# EAGLE design LB_BIT_w11_wirelessReceiver_v03(3_3)OHW (EAGLE 6.6.0)

## Sheet 1 of 2
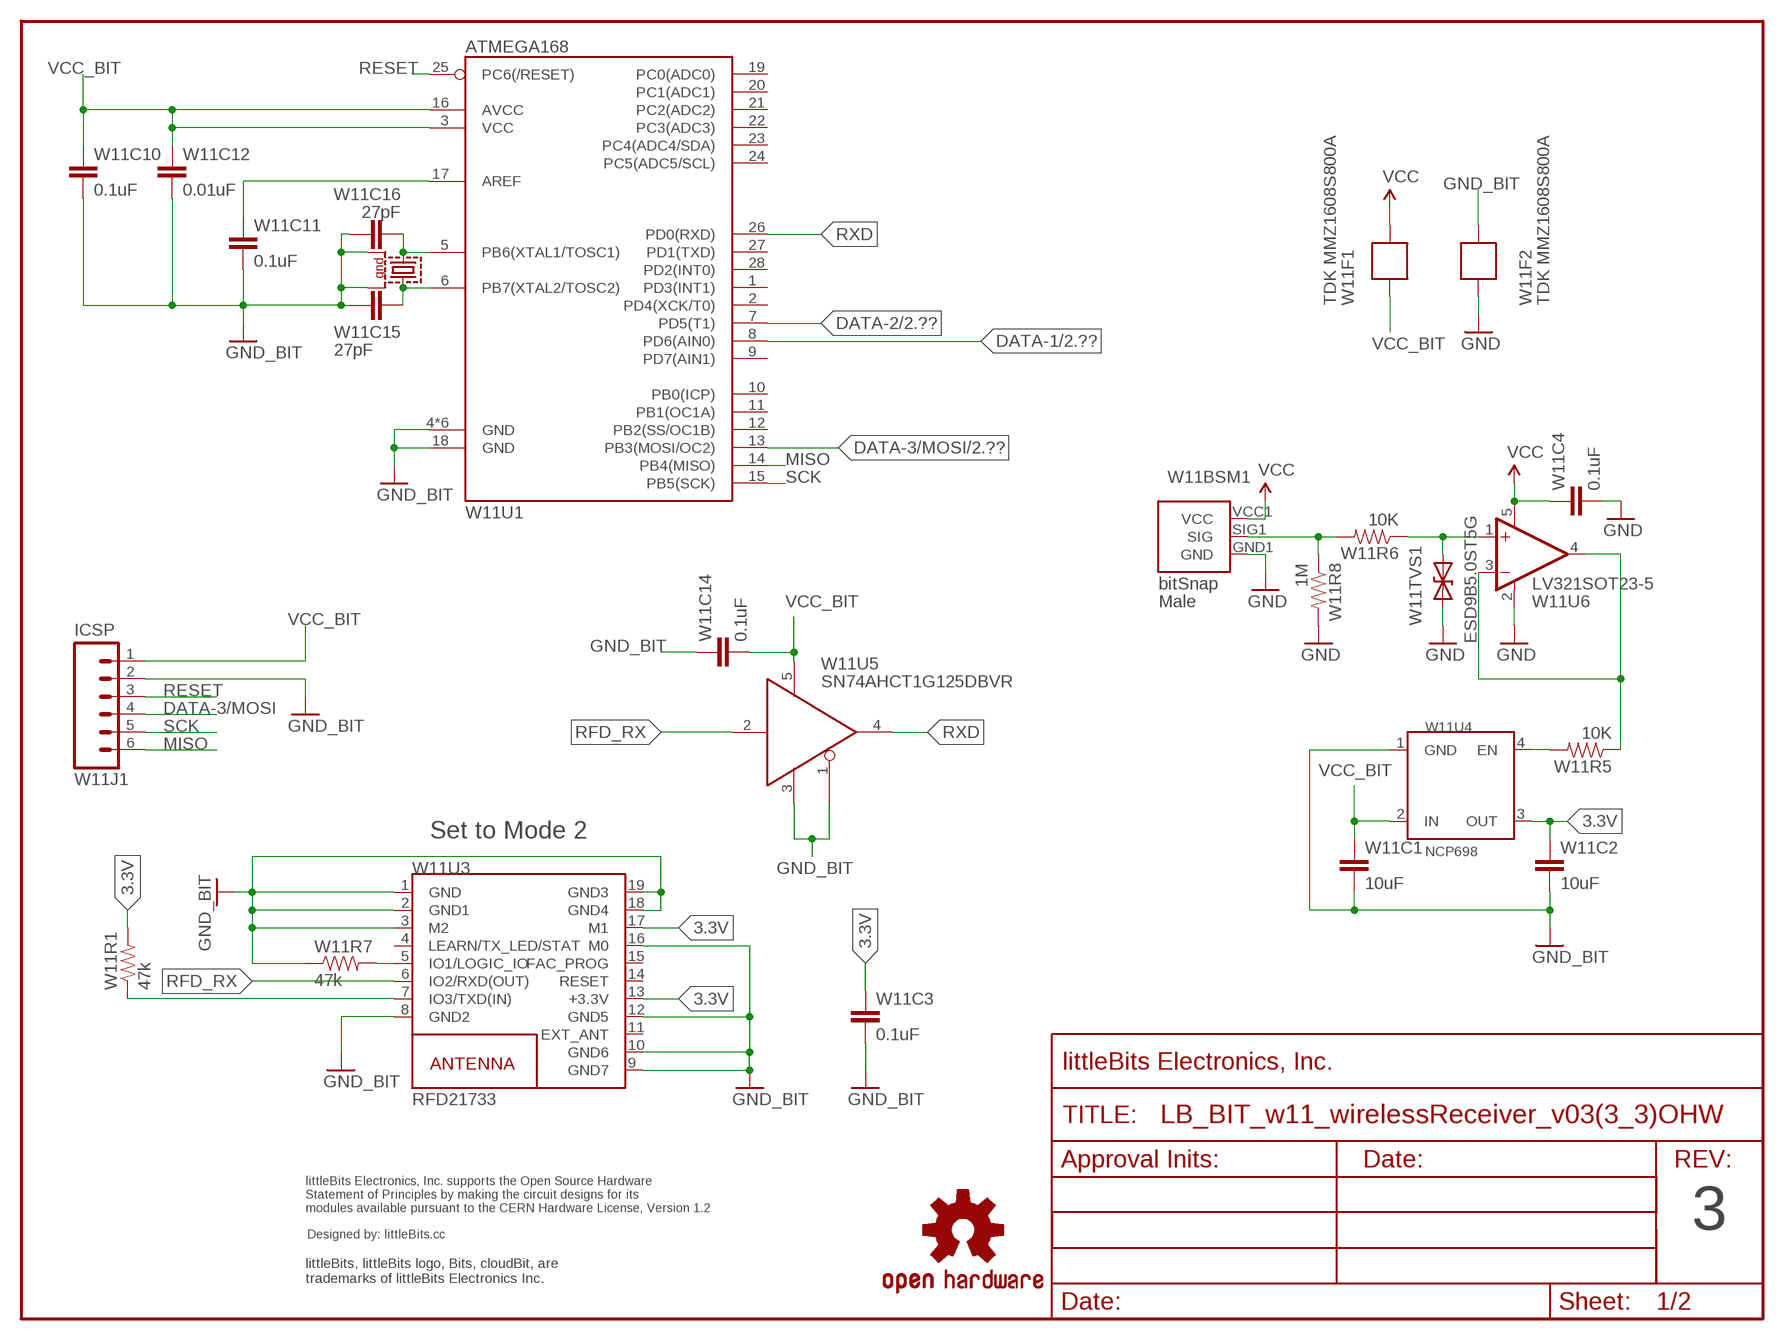
[diagram p0: schematic, sheet 1]

### Parts
FRAME1  FRAME-LETTER-OHWOHW  [FABDWG01-OHW]
U$3  OSHW-LOGOL  [OSHW-LOGO-L]
U$7  OSHWCREDIT  [OSHWCREDIT]
W11BSM1  BITSNAP_V03_MALE  [BITSNAP_V03_MALE]
W11C1  10uF  CAPCAP-0603  [CAP-0603]
W11C2  10uF  CAPCAP-0603  [CAP-0603]
W11C3  0.1uF  CAPCAP-0603  [CAP-0603]
W11C4  0.1uF  CAPCAP-0603  [CAP-0603]
W11C10  0.1uF  CAPCAP-0603  [CAP-0603]
W11C11  0.1uF  CAPCAP-0603  [CAP-0603]
W11C12  0.01uF  CAPCAP-0603  [CAP-0603]
W11C14  0.1uF  CAPCAP-0603  [CAP-0603]
W11C15  27pF  CAPCAP-0603  [CAP-0603]
W11C16  27pF  CAPCAP-0603  [CAP-0603]
W11F1  TDK MMZ1608S800A  FERRITE-BEAD  [R0603]
W11F2  TDK MMZ1608S800A  FERRITE-BEAD  [R0603]
W11J1  ICSP  HRD-60.1INCH_NO_SILKSCREEN  [SIP6-SM-0.1IN-NOS.S.]
W11R1  47k  RESISTOR0603  [RES-0603]
W11R5  10K  RESISTOR0603  [RES-0603]
W11R6  10K  RESISTOR0603  [RES-0603]
W11R7  47k  RESISTOR0603  [RES-0603]
W11R8  1M  RESISTOR0603  [RES-0603]
W11TVS1  ESD9B5.0ST5G  DIODE-TVSSOD-923  [SOD-923]
W11U1  ATMEGA168  ATMEGA168-28PINVFQFN-28  [VQFN28]
W11U3  RFD21733  RFD_CHIP  [RFD21733]
W11U4  NCP698  [NCP698_SC82-AB]
W11U5  SN74AHCT1G125DBVR  5V_TO_3.3V_LEVEL-SHIFTERSOT23-5  [SOT23-5]
W11U6  LV321SOT23-5  [SOT23-5]
W11X1  7B-8.000MAAJ-T  CRYSTAL-SMD-7B-SERIES-TXC  [CRYSTAL-SMD-7B-SERIES-5X3.2MM]

### Nets
3.3V: W11C2.1 W11C3.1 W11R1.2 W11U3.13(+3.3V) W11U3.17(M1) W11U4.3(OUT)
DATA-1: W11U1.8(PD6(AIN0)) ; also sheet 2
DATA-2: W11U1.7(PD5(T1)) ; also sheet 2
DATA-3/MOSI: W11J1.4 W11U1.13(PB3(MOSI/OC2)) ; also sheet 2
ENABLE: W11R5.2 W11U4.4(EN)
GND: W11BSM1.GND1(GND) W11C4.2 W11F2.2 W11R8.2 W11TVS1.1(A) W11U6.2(V-) ; also sheet 2
GND_BIT: W11C1.2 W11C2.2 W11C3.2 W11C10.2 W11C11.2 W11C12.2 W11C14.1 W11C15.2 W11C16.1 W11F2.1 W11J1.2 W11R7.1 W11U1.4(GND) W11U1.18(GND) W11U1.TH(GND) W11U1.TH@1(GND) W11U1.TH@2(GND) W11U1.TH@3(GND) W11U1.TH@4(GND) W11U3.1(GND) W11U3.2(GND1) W11U3.3(M2) W11U3.8(GND2) W11U3.9(GND7) W11U3.10(GND6) W11U3.12(GND5) W11U3.16(M0) W11U3.18(GND4) W11U3.19(GND3) W11U4.1(GND) W11U5.1 W11U5.3 W11X1.P$2 W11X1.P$4
MISO: W11J1.6 W11U1.14(PB4(MISO))
N$1: W11R6.1 W11TVS1.2(C) W11U6.1(+IN)
N$4: W11C11.1 W11U1.17(AREF)
N$6: W11R7.2 W11U3.5(IO1/LOGIC_IO)
N$7: W11BSM1.SIG1(SIG) W11R6.2 W11R8.1
N$8: W11C16.2 W11U1.5(PB6(XTAL1/TOSC1)) W11X1.P$1
N$9: W11C15.1 W11U1.6(PB7(XTAL2/TOSC2)) W11X1.P$3
N$10: W11R5.1 W11U6.3(-IN) W11U6.4(OUT)
RESET: W11J1.3 W11U1.25(PC6(/RESET))
RFD_RX: W11U3.6(IO2/RXD(OUT)) W11U5.2
RFD_TX: W11R1.1 W11U3.7(IO3/TXD(IN))
RXD: W11U1.26(PD0(RXD)) W11U5.4
SCK: W11J1.5 W11U1.15(PB5(SCK))
VCC: W11BSM1.VCC1(VCC) W11C4.1 W11F1.1 W11U6.5(V+) ; also sheet 2
VCC_BIT: W11C1.1 W11C10.1 W11C12.1 W11C14.2 W11F1.2 W11J1.1 W11U1.3(VCC) W11U1.16(AVCC) W11U4.2(IN) W11U5.5
Unconnected: W11U1.1(PD3(INT1)) W11U1.2(PD4(XCK/T0)) W11U1.9(PD7(AIN1)) W11U1.10(PB0(ICP)) W11U1.11(PB1(OC1A)) W11U1.12(PB2(SS/OC1B)) W11U1.19(PC0(ADC0)) W11U1.20(PC1(ADC1)) W11U1.21(PC2(ADC2)) W11U1.22(PC3(ADC3)) W11U1.23(PC4(ADC4/SDA)) W11U1.24(PC5(ADC5/SCL)) W11U1.27(PD1(TXD)) W11U1.28(PD2(INT0)) W11U3.4(LEARN/TX_LED/STAT) W11U3.11(EXT_ANT) W11U3.14(RESET) W11U3.15(FAC_PROG)

### Notes on the sheet
- Set to Mode 2
- 3

## Sheet 2 of 2
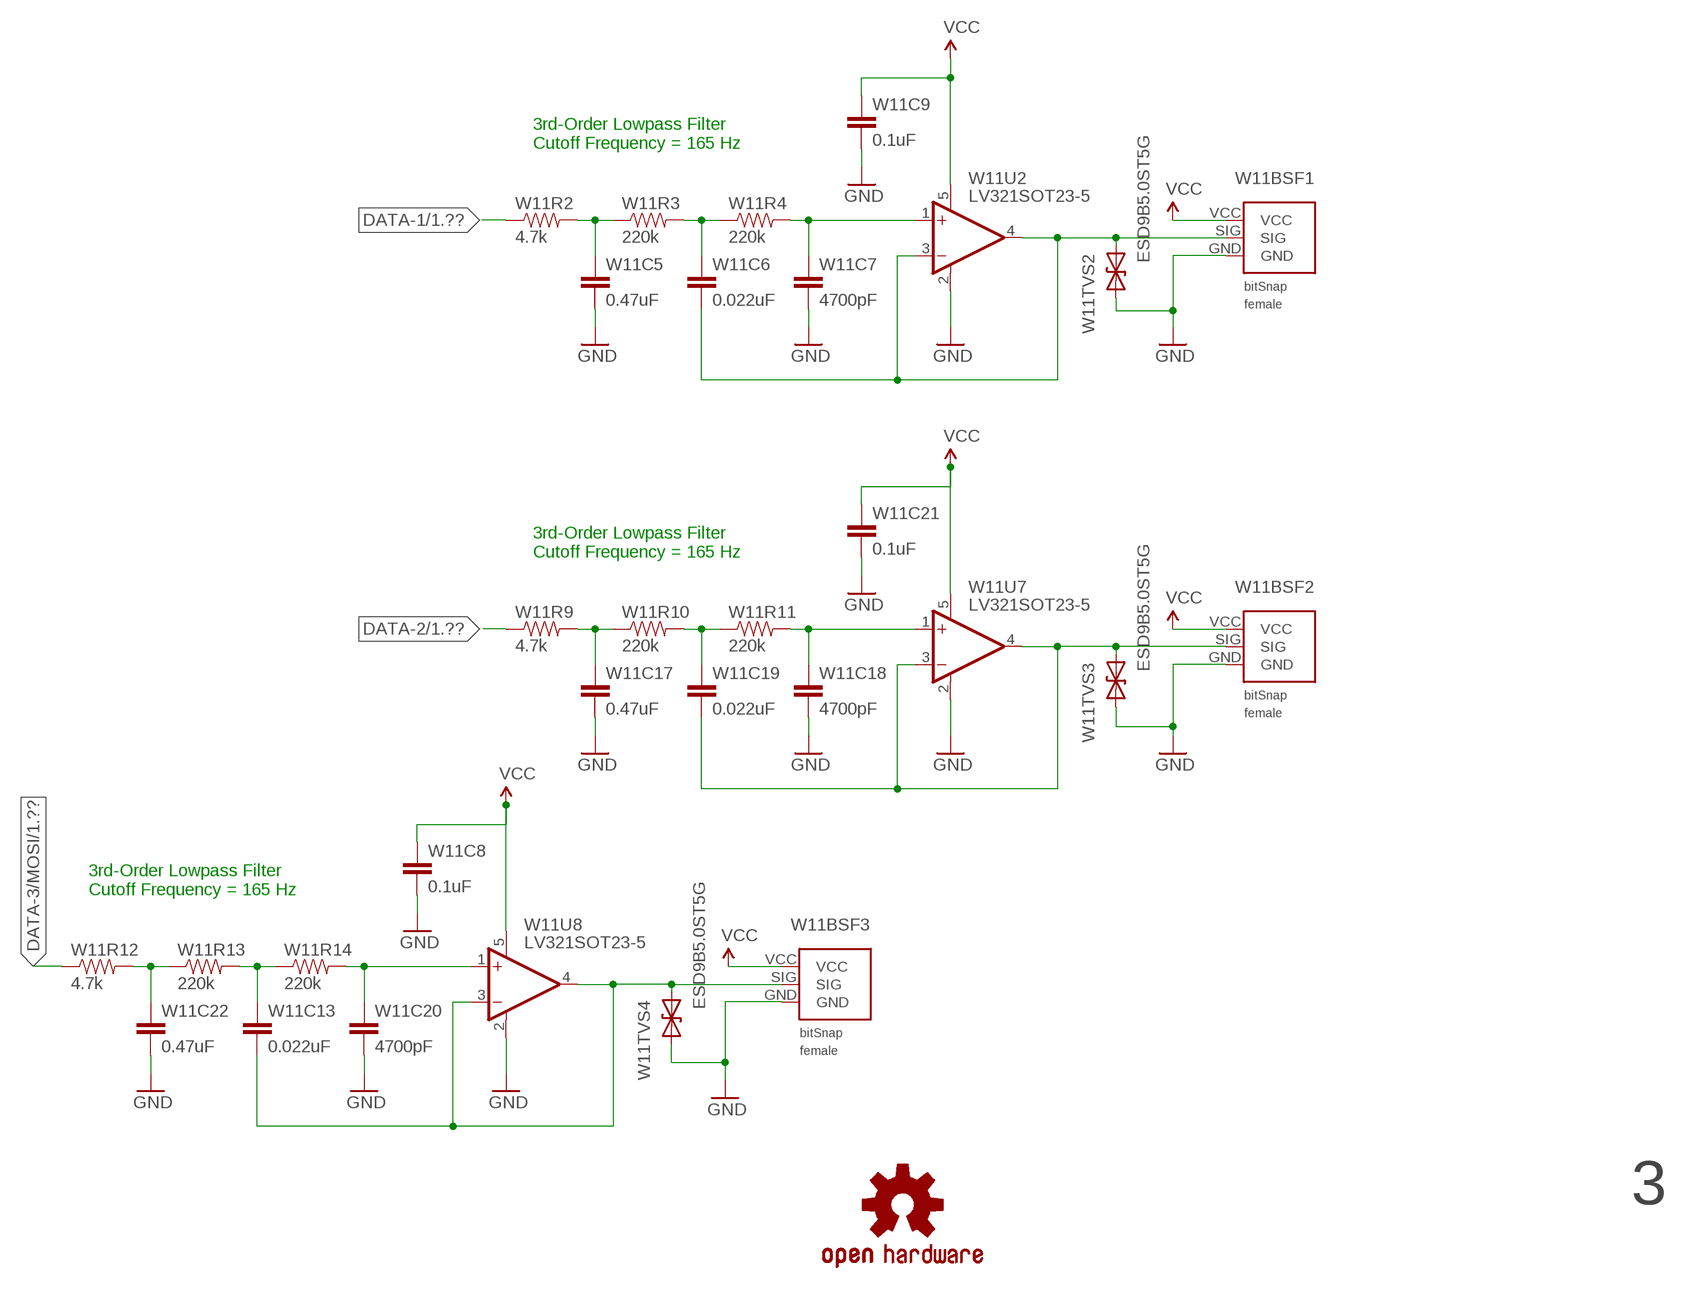
[diagram p1: schematic, sheet 2]

### Parts
U$9  OSHW-LOGOL  [OSHW-LOGO-L]
W11BSF1  BITSNAP_V03_FEMALE  [BITSNAP_V03_FEMALE]
W11BSF2  BITSNAP_V03_FEMALE  [BITSNAP_V03_FEMALE]
W11BSF3  BITSNAP_V03_FEMALE  [BITSNAP_V03_FEMALE]
W11C5  0.47uF  CAPCAP-0603  [CAP-0603]
W11C6  0.022uF  CAPCAP-0603  [CAP-0603]
W11C7  4700pF  CAPCAP-0603  [CAP-0603]
W11C8  0.1uF  CAPCAP-0603  [CAP-0603]
W11C9  0.1uF  CAPCAP-0603  [CAP-0603]
W11C13  0.022uF  CAPCAP-0603  [CAP-0603]
W11C17  0.47uF  CAPCAP-0603  [CAP-0603]
W11C18  4700pF  CAPCAP-0603  [CAP-0603]
W11C19  0.022uF  CAPCAP-0603  [CAP-0603]
W11C20  4700pF  CAPCAP-0603  [CAP-0603]
W11C21  0.1uF  CAPCAP-0603  [CAP-0603]
W11C22  0.47uF  CAPCAP-0603  [CAP-0603]
W11R2  4.7k  RESISTOR0603  [RES-0603]
W11R3  220k  RESISTOR0603  [RES-0603]
W11R4  220k  RESISTOR0603  [RES-0603]
W11R9  4.7k  RESISTOR0603  [RES-0603]
W11R10  220k  RESISTOR0603  [RES-0603]
W11R11  220k  RESISTOR0603  [RES-0603]
W11R12  4.7k  RESISTOR0603  [RES-0603]
W11R13  220k  RESISTOR0603  [RES-0603]
W11R14  220k  RESISTOR0603  [RES-0603]
W11TVS2  ESD9B5.0ST5G  DIODE-TVSSOD-923  [SOD-923]
W11TVS3  ESD9B5.0ST5G  DIODE-TVSSOD-923  [SOD-923]
W11TVS4  ESD9B5.0ST5G  DIODE-TVSSOD-923  [SOD-923]
W11U2  LV321SOT23-5  [SOT23-5]
W11U7  LV321SOT23-5  [SOT23-5]
W11U8  LV321SOT23-5  [SOT23-5]

### Nets
DATA-1: W11R2.1 ; also sheet 1
DATA-2: W11R9.1 ; also sheet 1
DATA-3/MOSI: W11R12.1 ; also sheet 1
GND: W11BSF1.GND W11BSF2.GND W11BSF3.GND W11C5.2 W11C7.2 W11C8.2 W11C9.2 W11C17.2 W11C18.2 W11C20.2 W11C21.2 W11C22.2 W11TVS2.1(A) W11TVS3.1(A) W11TVS4.1(A) W11U2.2(V-) W11U7.2(V-) W11U8.2(V-) ; also sheet 1
N$2: W11C6.1 W11R3.2 W11R4.1
N$3: W11C5.1 W11R2.2 W11R3.1
N$5: W11C7.1 W11R4.2 W11U2.1(+IN)
N$11: W11C17.1 W11R9.2 W11R10.1
N$12: W11C18.1 W11R11.2 W11U7.1(+IN)
N$14: W11C19.1 W11R10.2 W11R11.1
N$16: W11C22.1 W11R12.2 W11R13.1
N$17: W11C20.1 W11R14.2 W11U8.1(+IN)
N$19: W11C13.1 W11R13.2 W11R14.1
OUT-1: W11BSF1.SIG W11C6.2 W11TVS2.2(C) W11U2.3(-IN) W11U2.4(OUT)
OUT-2: W11BSF2.SIG W11C19.2 W11TVS3.2(C) W11U7.3(-IN) W11U7.4(OUT)
OUT-3: W11BSF3.SIG W11C13.2 W11TVS4.2(C) W11U8.3(-IN) W11U8.4(OUT)
VCC: W11BSF1.VCC W11BSF2.VCC W11BSF3.VCC W11C8.1 W11C9.1 W11C21.1 W11U2.5(V+) W11U7.5(V+) W11U8.5(V+) ; also sheet 1

### Notes on the sheet
- 3rd-Order Lowpass Filter
  Cutoff Frequency = 165 Hz
- 3rd-Order Lowpass Filter
  Cutoff Frequency = 165 Hz
- 3rd-Order Lowpass Filter
  Cutoff Frequency = 165 Hz
- 3

## Library data of the parts
FRAME1 = LITTLEBITS:FRAME-LETTER-OHW
U$3 U$9 = LITTLEBITS:OSHW-LOGO: Open Source Hardware Logo This logo indicates the piece of hardware it is found on incorporates a OSHW license and/or adheres to the definition of open source hardware found here: http://freedomdefined.org/OSHW
U$7 = LITTLEBITS:OSHWCREDIT
W11BSF1-W11BSF3 = bitSnap:BITSNAP_V03_FEMALE
W11BSM1 = bitSnap:BITSNAP_V03_MALE
W11C1-W11C22 = LITTLEBITS:CAP
W11F1 W11F2 = LITTLEBITS:FERRITE-BEAD
W11J1 = LITTLEBITS:HRD-6
W11R1-W11R14 = LITTLEBITS:RESISTOR
W11TVS1-W11TVS4 = LITTLEBITS:DIODE-TVS: Bidirectional Transient Voltage Suppression Diode: Device conducts in avalanche mode after reaching a part dependent voltage threshold. Used for limiting voltage spikes on ESD sensitive inputs and outputs.; IEC_ESD_PROT0: +/-18kV; LB_PN: ?; MPN: ESD9B5.0ST5G; V_CLAMP: ?; V_OPERATION: 5V
W11U1 = LITTLEBITS:ATMEGA168-28PIN
W11U2 W11U6-W11U8 = LITTLEBITS:LV321
W11U3 = LITTLEBITS:RFD_CHIP
W11U4 = LITTLEBITS:NCP698
W11U5 = LITTLEBITS:5V_TO_3.3V_LEVEL-SHIFTER: SN74LVC1G125
W11X1 = LITTLEBITS:CRYSTAL-SMD-7B-SERIES-TXC; MFG: TXC; MPN: 7B SERIES

## Board
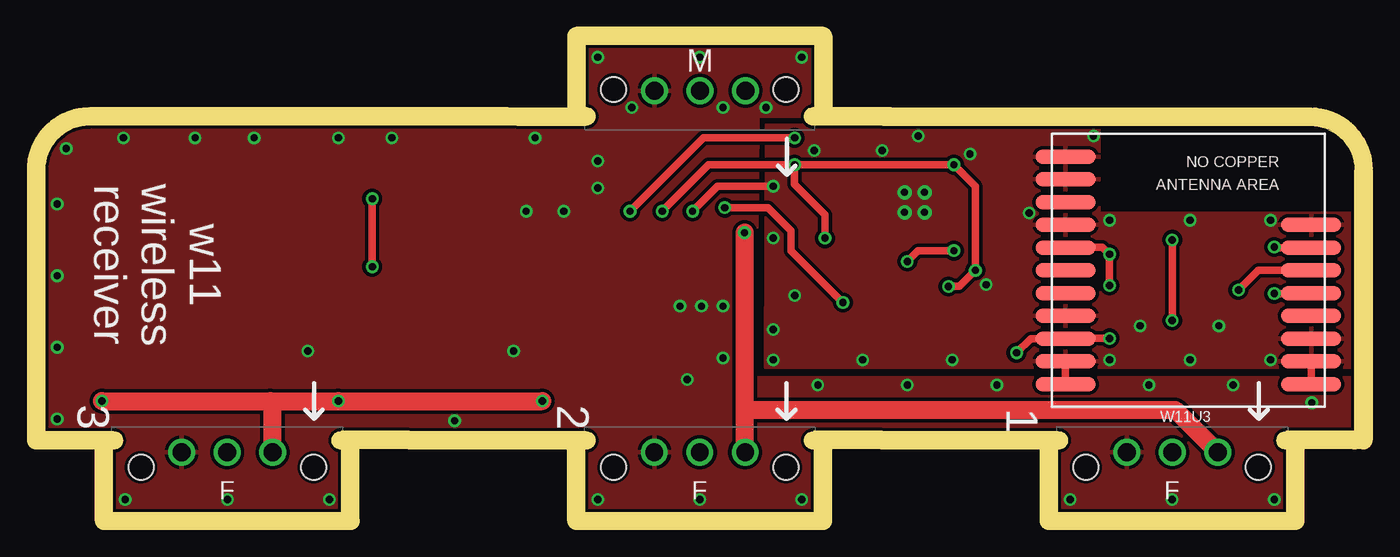
[diagram p2: board, top side]
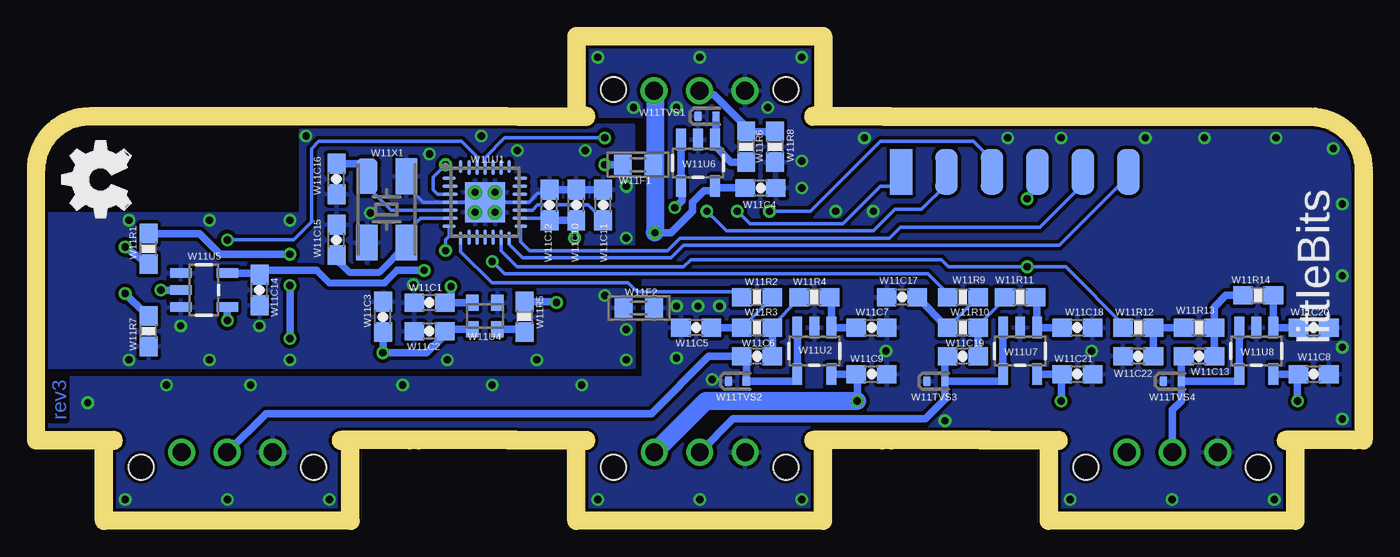
[diagram p3: board, bottom side, seen from below]

Size 73.2 x 26.1 mm. Coordinates in mm from the lower left corner, seen from the top.
Outline: 0,4.5 0,19.1 arc-90 2.5,21.6 26.4,21.6
Outline: 73.2,4.5 73.2,19.1 arc90 70.7,21.6 46.8,21.6
Outline: 20.4,4.5 30.17,4.5
Outline: 46.8,4.5 52.85,4.5
Copper layers (1*16): Top 0.035mm / dielectric 1.5mm / Bottom 0.035mm
Design rules "littleBitsDRC": minimum track width 0.2mm, minimum drill 0.4mm, track to track 0.2mm, track to pad 0.2mm, pad to pad 0.2mm, via to via 0.2mm, smd to smd 0mil, copper to edge 0.2mm, drill to drill 0.2mm, minimum pad ring 0.2mm, minimum via ring 0.15mm, stop-mask expansion 0.1mm, vias tented up to drill 0mil, thermal gap 0.2mm
tRestrict: area 59,16.8 to 73.2,21.6
bRestrict: area 59,16.8 to 73.2,21.6
Milling: 10 lines

### Footprints (pad centres in the part's own frame; a part is rotated, then mirrored left to right if it is on the bottom)
BITSNAP_V03_FEMALE = drill 1: GND 3.91,3.33; SIG 6.45,3.33; VCC 8.99,3.33 | hole 1.4: 1.63,2.5; 11.27,2.5
BITSNAP_V03_MALE = drill 1: GND1 8.98,2.56; SIG1 6.44,2.56; VCC1 3.9,2.56 | hole 1.4: 11.27,2.5; 1.63,2.5
CAP-0603 = smd 1.1 x 1: 1 -0.85,0; 2 0.85,0
R0603 = smd 1 x 1.1: 1 -0.85,0; 2 0.85,0
SIP6-SM-0.1IN-NOS.S. = smd 1.27 x 2.54: 1 -6.35,0; 2 -3.81,0; 3 -1.27,0; 4 1.27,0; 5 3.81,0; 6 6.35,0
RES-0603 = smd 1.1 x 1: 1 -0.85,0; 2 0.85,0
SOD-923 = smd 0.4 x 0.5: 1 -0.5,0; 2 0.5,0
VQFN28 = smd 0.75 x 0.2: 1 -2,1.35; 7 -2,-1.35; 15 2,-1.35; 21 2,1.35 | smd 0.85 x 0.2: 2 -1.95,0.9; 3 -1.95,0.455; 4 -1.95,0; 5 -1.95,-0.45; 6 -1.95,-0.9; 16 1.95,-0.9; 17 1.95,-0.45; 18 1.95,0; 19 1.95,0.45; 20 1.95,0.9 | smd 0.2 x 0.75: 8 -1.35,-2; 14 1.35,-2; 22 1.35,2; 28 -1.35,2 | smd 0.2 x 0.85: 9 -0.9,-1.95; 10 -0.45,-1.95; 11 0,-1.95; 12 0.45,-1.95; 13 0.9,-1.95; 23 0.9,1.95; 24 0.45,1.95; 25 0,1.95; 26 -0.45,1.95; 27 -0.9,1.95 | smd 2.25 x 2.25: TH 0,0 | drill 0.406 pad 0.406: TH@1 -0.559,0.559; TH@2 0.559,0.559; TH@3 -0.559,-0.559; TH@4 0.559,-0.559
SOT23-5 = smd 0.55 x 1.2: 1 -0.95,-1.3; 2 0,-1.3; 3 0.95,-1.3; 4 0.95,1.3; 5 -0.95,1.3
RFD21733 = smd 3.353 x 0.813: 1 -6.858,6.35; 2 -6.858,5.08; 3 -6.858,3.81; 4 -6.858,2.54; 5 -6.858,1.27; 6 -6.858,0; 7 -6.858,-1.27; 8 -6.858,-2.54; 9 6.858,-6.35; 10 6.858,-5.08; 11 6.858,-3.81; 12 6.858,-2.54; 13 6.858,-1.27; 14 6.858,0; 15 6.858,1.27; 16 6.858,2.54; 17 6.858,3.81; 18 6.858,5.08; 19 6.858,6.35
NCP698_SC82-AB = smd 0.7 x 0.9: 1 -0.7,-0.7; 2 0.7,-0.7; 3 0.7,0.8; 4 -0.7,0.8
CRYSTAL-SMD-7B-SERIES-5X3.2MM = smd 2 x 1.2: P$1 -1.85,-1.1; P$2 1.85,-1.1; P$3 1.85,1.1; P$4 -1.85,1.1

### Placement (x,y rotation side)
FRAME1  23,-12.9 0 top  (outside the outline)
U$3  -2.3,-83.3 0 top  (outside the outline)
U$7  -65.6,-78.5 0 top  (outside the outline)
U$9  -2.3,-83.3 0 top  (outside the outline)
U$21  [OSHW_FILLX150_NOTEXT]  68.4,15.62 0 top
W11BSF1  56.55,0 0 top
W11BSF2  30.15,0 0 top
W11BSF3  3.75,0 0 top
W11BSM1  43.05,26.1 180 top
W11C1  51.7,11.7 180 bottom
W11C2  51.7,10.1 180 bottom
W11C3  54.3,10.9 90 bottom
W11C4  33.2,18.1 0 bottom
W11C5  36.8,10.3 180 bottom
W11C6  33.4,8.7 180 bottom
W11C7  27,10.3 0 bottom
W11C8  2.3,7.7 0 bottom
W11C9  27,7.7 0 bottom
W11C10  43.5,17.15 90 bottom
W11C11  42,17.15 90 bottom
W11C12  45,17.15 90 bottom
W11C13  8.7,8.7 180 bottom
W11C14  61.2,12.4 90 bottom
W11C15  56.9,15.2 90 bottom
W11C16  56.9,18.6 90 bottom
W11C17  25.3,12 180 bottom
W11C18  15.5,10.3 0 bottom
W11C19  21.9,8.7 180 bottom
W11C20  2.3,10.3 0 bottom
W11C21  15.5,7.7 0 bottom
W11C22  12.1,8.7 180 bottom
W11F1  40.05,19.4 180 bottom
W11F2  40,11.4 0 bottom
W11J1  19,19 0 bottom
W11R1  67.4,14.7 90 bottom
W11R2  33.4,12 0 bottom
W11R3  33.4,10.3 0 bottom
W11R4  30.2,12 0 bottom
W11R5  46.4,10.9 270 bottom
W11R6  34,20.4 90 bottom
W11R7  67.4,10.1 90 bottom
W11R8  32.4,20.4 270 bottom
W11R9  21.9,12 0 bottom
W11R10  21.9,10.3 0 bottom
W11R11  18.7,12 0 bottom
W11R12  12.1,10.3 0 bottom
W11R13  8.7,10.3 0 bottom
W11R14  5.4,12.1 0 bottom
W11TVS1  36.2,22.1 0 bottom
W11TVS2  34.5,7.3 0 bottom
W11TVS3  23.4,7.3 0 bottom
W11TVS4  10.2,7.3 0 bottom
W11U1  48.6,17.3 0 bottom
W11U2  30.2,9 180 bottom
W11U3  63.9,13.5 180 top
W11U4  48.6,11 180 bottom
W11U5  64.3,12.4 270 bottom
W11U6  36.7,19.5 180 bottom
W11U7  18.7,9 180 bottom
W11U8  5.5,9 180 bottom
W11X1  54.1,16.9 270 bottom

### Tracks (layer width: path | path; a pad name or v marks a point on that pad's centre or on a via)
3.3V  (via drill 0.41)
  Top 0.203: 58.35,9.8 arc45 58.47,9.75 58.5,9.75
  Top 0.406: 58.35,9.75 57.1,9.75 W11U3.17 55.09,9.69 v54.3,8.9 | 58.35,9.75 58.1,9.65 58.15,9.7 v59.5,9.7 | 58.35,9.8 58.35,9.75 | W11U3.13 arc90 57.06,14.75 57.6,14.8 59.1,14.8 v59.5,14.4 v59.5,12.65
  Bottom 0.406: v59.5,9.7 v59.5,12.65 | W11U4.3 50.75,10.2 arc-90 W11C2.1 50.9,10.05 50.95,9.8 51.85,8.9 v54.3,8.9 W11C3.1 | W11R1.2 64.55,15.55 63.4,14.4 v59.5,14.4
DATA-1
  Bottom 0.2: 49.95,14.55 W11U1.8
  Bottom 0.203: 34.4,12.3 40.1,12.3 40.6,12.8 48.2,12.8 49.95,14.55
  Bottom 0.406: W11R2.1 34.25,11.85 34.4,12.3
DATA-2  (via drill 0.41)
  Top 0.406: v50.8,14.6 48.8,14.6 v48.2,14
  Bottom 0.2: W11U1.7 50.6,15.4 50.8,15.2 v50.8,14.6 | 47.5,13.3 23.85,13.3 22.55,12
  Bottom 0.203: v48.2,14 47.5,13.3
  Bottom 0.406: 22.55,12 W11R9.1 | 22.55,11.8 W11R9.1 | 22.6,11.85 W11R9.1
DATA-3/MOSI  (via drill 0.41)
  Top 0.406: v18.3,17.5 v18.3,13.7
  Bottom 0.2: v18.3,13.7 22.7,13.7 23.1,14.1 37.1,14.1 37.5,13.7 46.8,13.7 47.7,14.6 W11U1.13
  Bottom 0.203: 47.7,15 W11U1.13 | 12.75,10.3 16.15,13.7 v18.3,13.7
  Bottom 0.406: W11R12.1 12.75,10.3 | W11J1.4 17.7,18.57 v18.3,17.5
ENABLE
  Bottom 0.203: 46.45,10.2 46.4,10.15 W11R5.2
  Bottom 0.406: W11U4.4 46.45,10.2
GND  (via drill 0.41)
  other vias: 4.5,0.7 15.9,0.7 30.9,0.7 42.3,0.7 57.3,0.7 68.7,0.7 43.2,7.1 48.2,7.1 53.2,7.1 42.3,25.4 30.9,25.4 29,16.8 26.9,16.8 61.7,7.1 66.4,7.1 70.8,6.1 0.7,9.2 14.7,9 26.2,9 35.9,7.4 37.9,11.5 35.5,11.5 36.7,11.5 37.9,8.6 40.3,22.6 37.9,22.6 32.8,22.6 30.9,18.1 30.9,19.6 0.7,5.2 0.7,13.2 0.7,17.2 1.2,20.3 4.4,20.9 8.4,20.9 11.7,20.9 16.4,20.9 19.4,20.9 27.4,20.9 22.9,5.1 10.2,0.7 36.6,0.7 63,0.7 36.6,25.4
  pour Bottom: 73.2,7.5 73.2,0 0,0 0,26.1 43,26.1 43,22.1 39.8,22.1 39.74,7.5
  pour Top: 0,26.1 43,26.1 43,22.1 39.85,22.1 39.75,7.5 73.2,7.5 73.2,0 0,0
GND_BIT  (via drill 0.41)
  Top 0.203: W11U3.16 arc45 57.19,10.9
  Top 0.406: W11U3.18 W11U3.19 | W11U3.2 W11U3.1 | W11U3.3 | 72.06,16.04 W11U3.8 | v36.2,16.8 37.6,18.2 v40.7,18.2
  Bottom 0.2: 46.15,17.3 45.65,17.8 45.3,17.8 44.75,17.85 W11C12.2 | W11X1.P$4 53,18.53 53.15,18.38 | 25.7,16.9 26.9,15.7 35.1,15.7 v36.2,16.8
  Bottom 0.203: W11U1.TH W11U1.4 52.05,17.3 52.95,18.2 53.25,18.4 53.15,18.38 52.6,18.3 | W11U1.TH@4 W11U1.TH | W11U1.TH W11U1.18 46.15,17.3 | W11X1.P$4 53.43,19.18 arc45 53.5,19.36 53.5,19.6 | 22.81,18.29 24.2,16.9 25.7,16.9
  Bottom 0.406: W11C11.2 W11C10.2 W11C12.2 | W11J1.2 22.81,18.29 | v40.7,18.2 40.7,18
  other vias: 40.7,8.5 45.7,8.5 50.7,8.5 55,16.7 51.7,20 52.6,12.7 41.9,12.1 61.2,10.4 65.6,10.4 59.5,16.3 64,16.3 68.5,16.3 68.5,8.5 64,8.5 59.5,8.5 43,20.2 46.8,20.2 48.8,21 58.6,21 40.7,15.3 40.7,10.2
  pour Bottom: 40.3,21.6 58.95,21.6 58.95,16.7 73.2,16.65 73.2,8.1 40.27,8.1
  pour Top: 40.32,21.64 59.35,21.6 59.35,16.75 73.2,16.7 73.2,8.1 40.28,8.1
  pour Top (no thermals): 47.3,18.6 49.9,18.6 49.9,16 47.3,16
MISO
  Bottom 0.2: 46.5,14.2 38.2,14.2 37.5,14.9 16.5,14.9 12.7,18.7
  Bottom 0.203: W11U1.14 47.25,14.95 46.5,14.2
  Bottom 0.406: 12.7,18.7 12.7,19.45 W11J1.6
N$1
  Bottom 0.406: W11TVS1.2 35.7,20.8 W11U6.1 35.75,20.45 34.85,19.55 W11R6.1
N$2
  Bottom 0.203: W11R4.1 31.05,11.9 32.55,10.4 W11R3.2
  Bottom 0.406: W11C6.1 W11R3.2
N$3
  Bottom 0.203: W11R2.2 W11R3.1
  Bottom 0.406: W11C5.1 W11R3.1
N$4
  Bottom 0.2: W11U1.17 45.95,16.85 45.65,17.15 42.85,17.15 W11C11.1
N$5
  Bottom 0.406: 29.24,11.9 W11R4.2 29.25,11.9 W11U2.1 | W11C7.1 W11U2.1 | W11U2.1
N$6  (via drill 0.41)
  Top 0.406: W11U3.5 70.73,12.2 v68.7,12.2
  Bottom 0.406: v68.7,12.2 67.6,11.1 67.5,10.9 W11R7.2
N$7
  Bottom 0.406: W11R8.1 W11R6.2 34,21.5 35.8,23.3 36.1,23.3 36.34,23.54 W11BSM1.SIG1
N$8
  Bottom 0.203: W11U1.5 53.85,16.85 55.2,18.2
  Bottom 0.406: 55.2,18.2 55.1,18.65 W11X1.P$1 55.2,19.45 W11C16.2
N$9
  Bottom 0.203: W11U1.6 52.2,16.4 52.9,15.7
  Bottom 0.4: 56.7,13.9 56.2,13.4 54.5,13.4 53,14.9
  Bottom 0.406: W11C15.1 56.7,14.15 56.7,13.9 | 53,14.9 W11X1.P$3 52.9,15.7
N$10  (via drill 0.41)
  Top 0.406: v38,17 40.4,17 41.7,15.7 41.7,14.6 v44.6,11.7
  Bottom 0.406: W11U6.3 W11U6.4 37.65,18.1 | 37.65,17.9 37.65,18.1 | 37.65,18.1 37.6,18 37.6,17.4 v38,17 | v44.6,11.7 44.75,11.75 W11R5.1
N$11
  Bottom 0.203: W11R9.2 W11R10.1
  Bottom 0.406: W11R10.1 W11C17.1
N$12
  Bottom 0.406: W11C18.1 W11U7.1 17.75,11.9 W11R11.2 | W11C18.1
N$14
  Bottom 0.203: W11R11.1 19.55,11.9 21.05,10.4 W11R10.2
  Bottom 0.406: 19.4,12.05 W11R11.1 | W11R10.2 W11C19.1
N$16
  Bottom 0.406: W11R13.1 W11R12.2 W11C22.1
N$17
  Bottom 0.406: W11C20.1 W11U8.1 | W11U8.1 | W11R14.2 W11U8.1
N$19
  Bottom 0.406: W11R14.1 7.2,12.1 7.85,11.45 W11R13.2 W11C13.1
OUT-1
  Bottom 0.406: W11U2.3 W11U2.4 31.15,7.3 W11TVS2.2 34,8.35 W11C6.2 36.1,8.7 39.3,5.5 60.83,5.5 W11BSF1.SIG
OUT-2
  Bottom 0.406: W11U7.3 W11U7.4 19.65,7.3 W11TVS3.2 | W11TVS3.2 22.9,8.55 W11C19.2 | W11TVS3.2 22.9,6.3 24,5.2 34.73,5.2 W11BSF2.SIG
OUT-3
  Bottom 0.406: W11U8.3 W11U8.4 6.45,7.3 W11TVS4.2 | W11TVS4.2 9.7,8.65 arc90 W11C13.2 | W11TVS4.2 9.7,6.2 10.2,5.7 W11BSF3.SIG
RESET  (via drill 0.41)
  Top 0.406: v41.9,20.9 36.8,20.9 v32.7,16.8
  Bottom 0.2: W11U1.25 48.6,19.8 47.5,20.9 v41.9,20.9
  Bottom 0.203: v32.7,16.8 30.4,16.8 26.5,20.7 21.3,20.7 20.4,19.8
  Bottom 0.406: 20.4,19.8 20.3,19.5 20.37,18.23 W11J1.3
RFD_RX  (via drill 0.41)
  Top 0.406: v66.7,12.4 67.8,13.5 W11U3.6
  Bottom 0.406: W11U5.2 v66.7,12.4
RFD_TX  (via drill 0.41)
  Top 0.406: v68.7,14.8 68.73,14.77 W11U3.7
  Bottom 0.406: W11R1.1 v68.7,14.8
RXD  (via drill 0.41)
  Top 0.406: v63,10.7 v63,15.2
  Bottom 0.2: v63,15.2 59.3,15.2 58.3,16.2 58.3,20.3 57.9,20.7 49.9,20.7 49.05,19.85 W11U1.26
  Bottom 0.406: W11U5.4 | W11U5.4 v63,10.7
SCK
  Bottom 0.2: 46.6,15.1 46.1,14.6 38.4,14.6 37.7,15.3 26,15.3 25.4,15.9
  Bottom 0.203: W11U1.15 46.6,15.1 | 25.4,15.9 17.6,15.9 15.3,18.2
  Bottom 0.406: 15.3,18.2 15.2,19.41 W11J1.5
VCC  (via drill 0.41)
  Top 0.406: 12.74,6.16 12.6,6.2
  Top 1: v3.2,6.2 12.6,6.2 v16.4,6.2 v27.8,6.2 | 39.1,5.7 39.1,3.3 W11BSF2.VCC | W11BSF3.VCC 12.74,6.16 | 39.1,5.7 63.17,5.7 W11BSF1.VCC | v39.1,15.6 39.1,5.7
  Bottom 0.406: W11U7.5 W11C21.1 16.4,7.65 v16.4,6.2 | W11U7.5 | W11U2.5 | W11C8.1 3.2,7.65 | 3.2,7.65 v3.2,6.2 | W11C9.1 | v27.8,6.2 27.8,7.65 W11C9.1 | 3.2,7.65 3.25,7.7 W11U8.5 | W11C9.1 W11U2.5 | W11F1.1 39.1,20.4 v39.1,15.6 38.2,15.6 37,16.8 37,17.3 36.35,17.95 35.85,17.95 W11U6.5 35.65,18.1 W11C4.1 | 39.1,23.5 W11BSM1.VCC1
  Bottom 1: v27.8,6.2 36.27,6.2 W11BSF2.VCC | 39.1,23.5 v39.1,15.6
VCC_BIT  (via drill 0.41)
  Top 0.406: v41.9,19.4 v50.8,19.4 52,18.2 v52,13.5 51.1,12.6 v50.5,12.6 | v41.9,19.4 37.1,19.4 v34.5,16.8 | v43.6,15.3 43.6,16.6 41.9,18.3 v41.9,19.4
  Bottom 0.2: W11U1.3 51.25,17.76 51.5,18 51.5,18.7 v50.8,19.4 | W11C10.1 43.7,16.1 43.6,16.1 | W11U1.16 45.4,16.4 arc90 W11C12.1 | v34.5,16.8 33.8,16.1 28.6,16.1 26.5,18.2 25.35,18.2
  Bottom 0.4: 58,13.5 57.3,12.8 54.2,12.8 53.5,13.5
  Bottom 0.406: 43.6,16.1 v43.6,15.3 | W11C12.1 W11C10.1 | 50.5,11.7 v50.5,12.6 | W11U4.2 50.5,11.7 | 50.5,11.7 W11C1.1 | 25.35,18.2 W11J1.1 | W11F1.2 v41.9,19.4 | 58,13.5 60.95,13.5 W11C14.2 arc-90 61.3,13.35 W11U5.5 | 53.5,13.5 v52,13.5

### Text on the board
Bottom: rev3
tPlace: w11 / wireless / receiver | 3 | 2 | 1
bPlace: littleBits
Milling: 1mm DIA. ROUTER PATH
Measures: C.L.
dxf: 3 | Wireless Radio Receiver Bit